# EAGLE design CS4272-breakout-board (EAGLE 8.6.3)
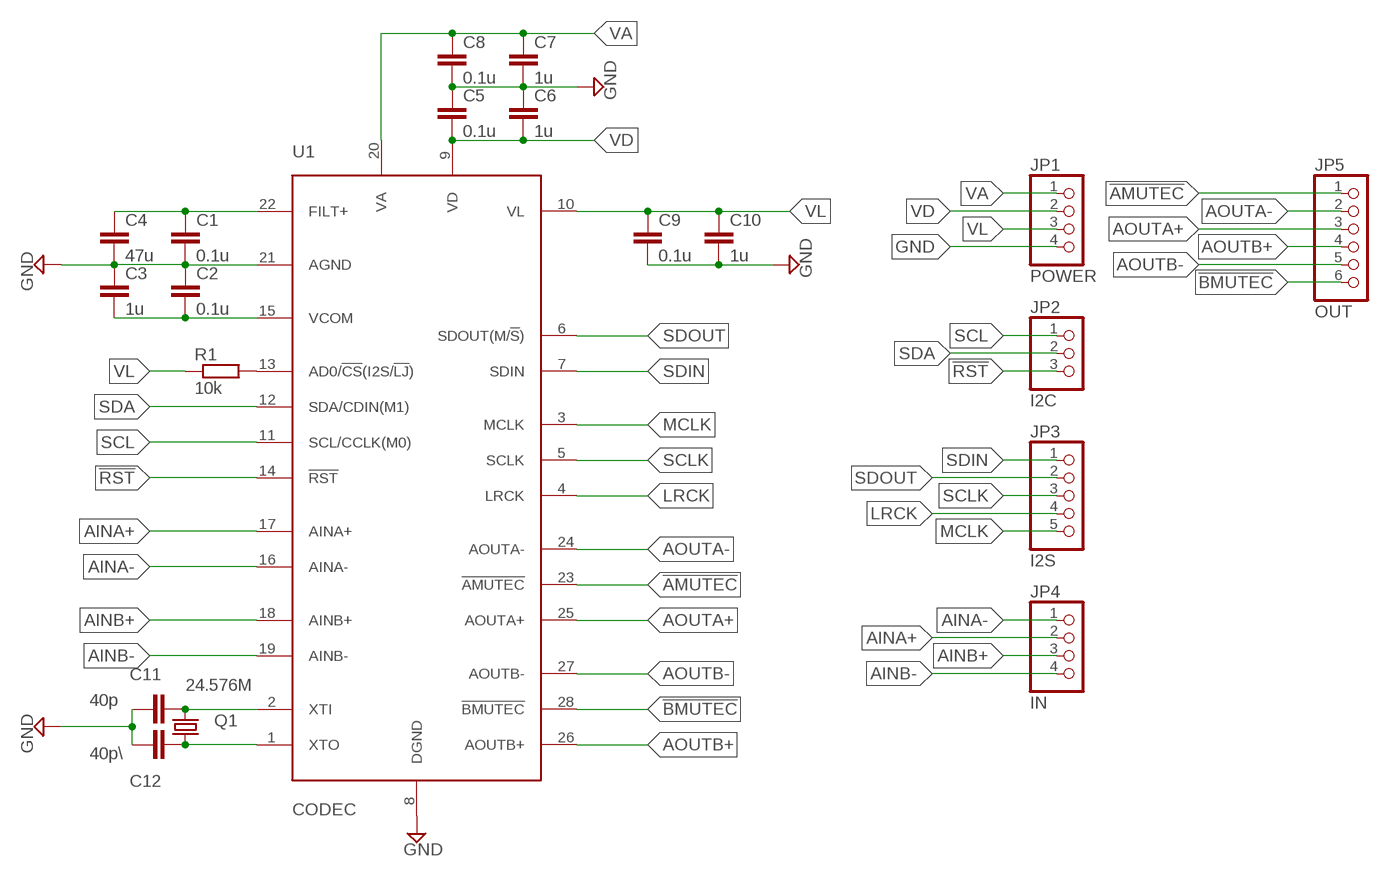
[diagram p0: schematic, sheet 1]

## Parts
C1  0.1u  C-EUC0603  [C0603]
C2  0.1u  C-EUC0603  [C0603]
C3  1u  C-EUC0603  [C0603]
C4  47u  C-EUC0603  [C0603]
C5  0.1u  C-EUC0603  [C0603]
C6  1u  C-EUC0603  [C0603]
C7  1u  C-EUC0603  [C0603]
C8  0.1u  C-EUC0603  [C0603]
C9  0.1u  C-EUC0603  [C0603]
C10  1u  C-EUC0603  [C0603]
C11  40p  C-EUC0603  [C0603]
C12  40p\  C-EUC0603  [C0603]
JP1  POWER  PINHD-1X4  [1X04]
JP2  I2C  PINHD-1X3  [1X03]
JP3  I2S  PINHD-1X5  [1X05]
JP4  IN  PINHD-1X4  [1X04]
JP5  OUT  PINHD-1X6  [1X06]
Q1  24.576M  CRYSTALHC49U-V  [HC49U-V]
R1  10k  R-EU_R0603  [R0603]
U1  CODEC  CS4272  [TSSOP-28]

## Nets
!AMUTEC!: JP5.1 U1.23(!AMUTEC!)
!BMUTEC!: JP5.6 U1.28(!BMUTEC!)
!RST!: JP2.3 U1.14(!RST!)
AINA+: JP4.2 U1.17(AINA+)
AINA-: JP4.1 U1.16(AINA-)
AINB+: JP4.3 U1.18(AINB+)
AINB-: JP4.4 U1.19(AINB-)
AOUTA+: JP5.3 U1.25(AOUTA+)
AOUTA-: JP5.2 U1.24(AOUTA-)
AOUTB+: JP5.4 U1.26(AOUTB+)
AOUTB-: JP5.5 U1.27(AOUTB-)
FILT+: C1.1 C4.1 U1.22(FILT+)
GND: C1.2 C2.1 C3.1 C4.2 C5.1 C6.1 C7.2 C8.2 C9.2 C10.2 C11.1 C12.1 JP1.4 U1.8(DGND) U1.21(AGND)
LRCK: JP3.4 U1.4(LRCK)
MCLK: JP3.5 U1.3(MCLK)
N$1: C12.2 Q1.1 U1.1(XTO)
N$2: C11.2 Q1.2 U1.2(XTI)
N$5: R1.2 U1.13(AD0/!CS!(I2S/!LJ!))
SCL: JP2.1 U1.11(SCL/CCLK(M0))
SCLK: JP3.3 U1.5(SCLK)
SDA: JP2.2 U1.12(SDA/CDIN(M1))
SDIN: JP3.1 U1.7(SDIN)
SDOUT: JP3.2 U1.6(SDOUT(M/!S!))
VA: C7.1 C8.1 JP1.1 U1.20(VA)
VCOM: C2.2 C3.2 U1.15(VCOM)
VD: C5.2 C6.2 JP1.2 U1.9(VD)
VL: C9.1 C10.1 JP1.3 R1.1 U1.10(VL)

## Library data of the parts
C1-C12 = rcl:C-EU: CAPACITOR, European symbol; SPICEPREFIX: C
JP1 JP4 = pinhead:PINHD-1X4: PIN HEADER
JP2 = pinhead:PINHD-1X3: PIN HEADER
JP3 = pinhead:PINHD-1X5: PIN HEADER
JP5 = pinhead:PINHD-1X6: PIN HEADER
Q1 = crystal:CRYSTAL: CRYSTAL; OC_FARNELL: 1666969; OC_NEWARK: unknown
R1 = rcl:R-EU_: RESISTOR, European symbol; SPICEPREFIX: R
U1 = CS4272:CS4272: 24-bit, 192 kHz Stereo Audio CODEC D/A Features High Performance 114 dB Dynamic Range -100 dB THD+N Up to 192 kHz Sampling Rates Differential Analog Architecture Volume Control with Soft Ramp 1 dB Step Size Zero Crossing Click-free Transitions Selectable Digital Filters Fast and Slow Roll Off ATAPI Mixing Functions Selectable Serial Audio Interface Formats Left Justified up to 24-bit I2S up to 24-bit Right Justified 16-, 18-, 20-, and 24-bit Control Output for External Muting Selectable 50/15 us De-emphasis A/D Features High Performance 114 dB Dynamic Range -100 dB THD+N Up to 192 kHz Sampling Rates Differential Analog Architecture Multi-bit Delta Sigma Conversion High-pass Filter or DC Offset Calibration Low-Latency Digital Anti-alias Filtering Automatic Dithering of 16-bit Data Selectable Serial Audio Interface Formats Left Justified up to 24-bit I2S up to 24-bit System Features Direct Interface with 5V to 2.5V Logic Levels Internal Digital Loopback On-chip Oscillator Stand-Alone or Control Port Functionality

## Board
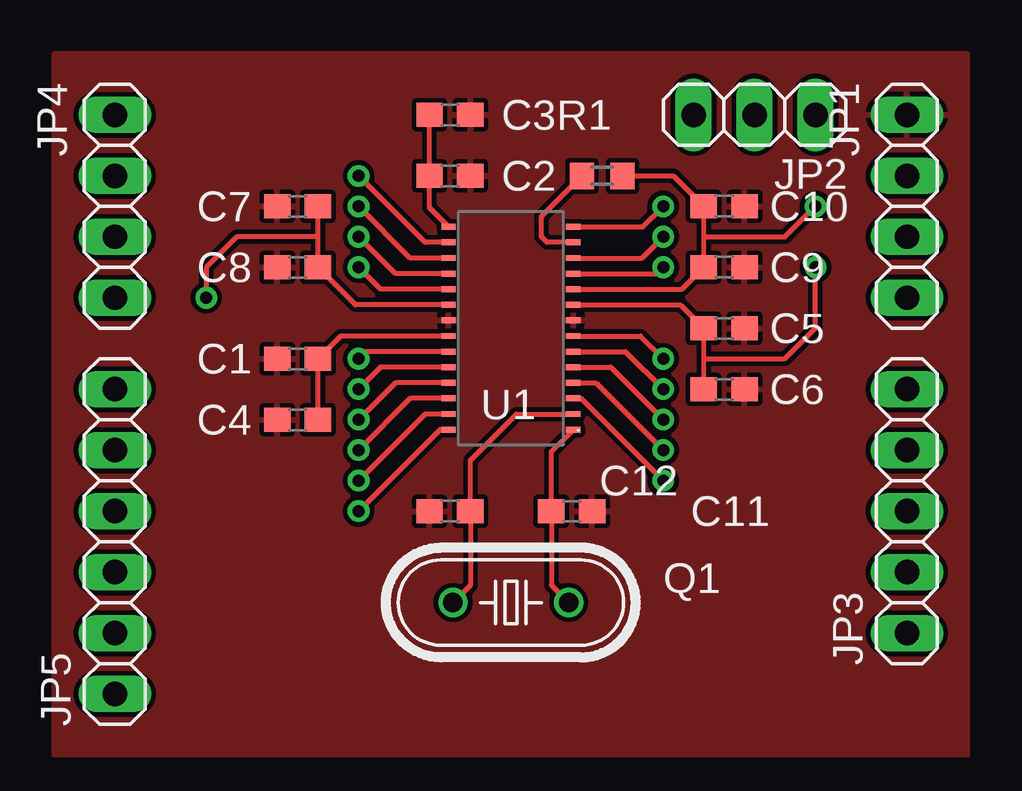
[diagram p1: board, top side]
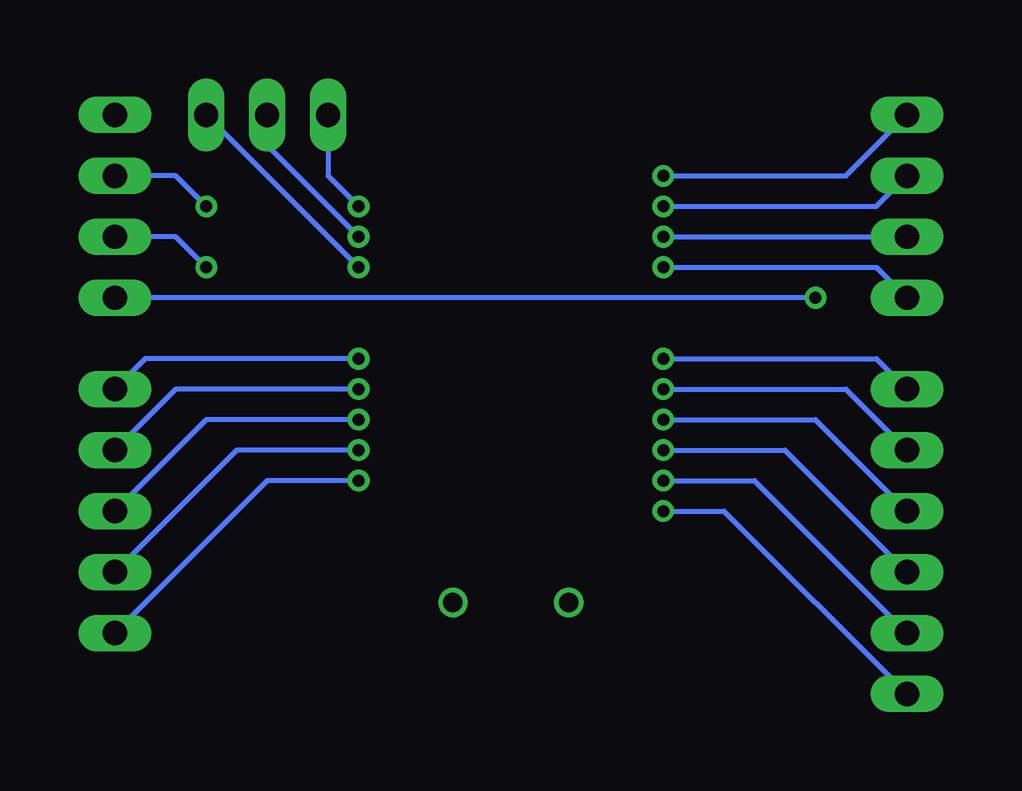
[diagram p2: board, bottom side, seen from below]

No outline drawn. Coordinates in mm, seen from the top.
Copper layers (1*16): Top 0.035mm / dielectric 1.5mm / Bottom 0.035mm
Design rules "minimal": minimum track width 0.2mm, minimum drill 0.5mm, track to track 0.2mm, track to pad 0.2mm, pad to pad 0.2mm, via to via 0.2mm, smd to smd 0.2mm, copper to edge 0.1mm, drill to drill 0.6mm, minimum pad ring 0.2mm, minimum via ring 0.2mm, stop-mask expansion 4mil, vias tented up to drill 0mil, thermal gap 0.2mm

### Footprints (pad centres in the part's own frame; a part is rotated, then mirrored left to right if it is on the bottom)
C0603 = smd 1.1 x 1: 1 -0.85,0; 2 0.85,0
1X04 = drill 1.016 long: 1 -3.81,0; 2 -1.27,0; 3 1.27,0; 4 3.81,0
1X03 = drill 1.016 long: 1 -2.54,0; 2 0,0; 3 2.54,0
1X05 = drill 1.016 long: 1 -5.08,0; 2 -2.54,0; 3 0,0; 4 2.54,0; 5 5.08,0
1X06 = drill 1.016 long: 1 -6.35,0; 2 -3.81,0; 3 -1.27,0; 4 1.27,0; 5 3.81,0; 6 6.35,0
HC49U-V = drill 0.813: 1 -2.413,0; 2 2.413,0
R0603 = smd 1 x 1.1: 1 -0.85,0; 2 0.85,0
TSSOP-28 = smd 0.245 x 0.6: 1 -4.225,-2.6; 2 -3.575,-2.6; 3 -2.925,-2.6; 4 -2.275,-2.6; 5 -1.625,-2.6; 6 -0.975,-2.6; 7 -0.325,-2.6; 8 0.325,-2.6; 9 0.975,-2.6; 10 1.625,-2.6; 11 2.275,-2.6; 12 2.925,-2.6; 13 3.575,-2.6; 14 4.225,-2.6; 15 4.225,2.6; 16 3.575,2.6; 17 2.925,2.6; 18 2.275,2.6; 19 1.625,2.6; 20 0.975,2.6; 21 0.325,2.6; 22 -0.325,2.6; 23 -0.975,2.6; 24 -1.625,2.6; 25 -2.275,2.6; 26 -2.925,2.6; 27 -3.575,2.6; 28 -4.225,2.6

### Placement (x,y rotation side)
C1  15.24,24.13 180 top
C2  21.59,31.75 180 top
C3  21.59,34.29 180 top
C4  15.24,21.59 180 top
C5  33.02,25.4 180 top
C6  33.02,22.86 180 top
C7  15.24,30.48 180 top
C8  15.24,27.94 180 top
C9  33.02,27.94 0 top
C10  33.02,30.48 0 top
C11  21.59,17.78 0 top
C12  26.67,17.78 180 top
JP1  40.64,30.48 90 top
JP2  34.29,34.29 180 top
JP3  40.64,17.78 270 top
JP4  7.62,30.48 270 top
JP5  7.62,16.51 270 top
Q1  24.13,13.97 180 top
R1  27.94,31.75 180 top
U1  24.13,25.4 90 top

### Tracks (layer width: path | path; a pad name or v marks a point on that pad's centre or on a via)
!AMUTEC!  (via drill 0.5)
  Top 0.2: U1.23 18.07,24.43 v17.78,24.13
  Bottom 0.2: JP5.1 8.89,24.13 v17.78,24.13
!BMUTEC!  (via drill 0.5)
  Top 0.2: U1.28 21.18,21.18 v17.78,17.78
  Bottom 0.2: v17.78,17.78 15.24,17.78 JP5.6
!RST!  (via drill 0.5)
  Top 0.2: U1.14 29.62,29.62 v30.48,30.48
  Bottom 0.2: JP2.3 31.75,31.75 v30.48,30.48
AINA+  (via drill 0.5)
  Top 0.2: U1.17 19.93,28.32 v17.78,30.48
  Bottom 0.2: v17.78,30.48 8.89,30.48 JP4.2
AINA-  (via drill 0.5)
  Top 0.2: U1.16 20.55,28.98 v17.78,31.75
  Bottom 0.2: v17.78,31.75 10.16,31.75 JP4.1
AINB+  (via drill 0.5)
  Top 0.2: U1.18 19.32,27.68 v17.78,29.21
  Bottom 0.2: v17.78,29.21 JP4.3
AINB-  (via drill 0.5)
  Top 0.2: U1.19 18.7,27.02 v17.78,27.94
  Bottom 0.2: JP4.4 8.89,27.94 v17.78,27.94
AOUTA+  (via drill 0.5)
  Top 0.2: U1.25 19.32,23.12 v17.78,21.59
  Bottom 0.2: v17.78,21.59 11.43,21.59 JP5.3
AOUTA-  (via drill 0.5)
  Top 0.2: U1.24 18.7,23.77 v17.78,22.86
  Bottom 0.2: v17.78,22.86 10.16,22.86 JP5.2
AOUTB+  (via drill 0.5)
  Top 0.2: U1.26 19.93,22.48 v17.78,20.32
  Bottom 0.2: v17.78,20.32 12.7,20.32 JP5.4
AOUTB-  (via drill 0.5)
  Top 0.2: U1.27 20.55,21.82 v17.78,19.05
  Bottom 0.2: v17.78,19.05 13.97,19.05 JP5.5
FILT+
  Top 0.2: C4.1 C1.1 17.04,25.07 U1.22
GND
  pour Top: 5.08,7.62 43.18,7.62 43.18,36.83 5.08,36.83
LRCK  (via drill 0.5)
  Top 0.2: U1.4 27.68,23.12 v30.48,20.32
  Bottom 0.2: JP3.4 35.56,20.32 v30.48,20.32
MCLK  (via drill 0.5)
  Top 0.2: U1.3 27.05,22.48 v30.48,19.05
  Bottom 0.2: v30.48,19.05 34.29,19.05 JP3.5
N$1
  Top 0.2: U1.1 25.82,20.27 C12.2 25.82,14.69 Q1.1
N$2
  Top 0.2: U1.2 24.36,21.82 22.44,19.9 C11.2 22.44,14.69 Q1.2
N$5
  Top 0.2: U1.13 25.64,28.98 25.4,29.21 25.4,30.06 R1.2
SCL  (via drill 0.5)
  Top 0.2: U1.11 30.21,27.68 v30.48,27.94
  Bottom 0.2: v30.48,27.94 JP2.1
SCLK  (via drill 0.5)
  Top 0.2: U1.5 28.3,23.77 v30.48,21.59
  Bottom 0.2: JP3.3 36.83,21.59 v30.48,21.59
SDA  (via drill 0.5)
  Top 0.2: U1.12 29.59,28.32 v30.48,29.21
  Bottom 0.2: JP2.2 34.29,33.02 v30.48,29.21
SDIN  (via drill 0.5)
  Top 0.2: U1.7 29.54,25.07 v30.48,24.13
  Bottom 0.2: v30.48,24.13 35.56,24.13 39.37,24.13 JP3.1
SDOUT  (via drill 0.5)
  Top 0.2: U1.6 28.91,24.43 v30.48,22.86
  Bottom 0.2: JP3.2 38.1,22.86 v30.48,22.86
VA  (via drill 0.5)
  Top 0.2: U1.20 17.66,26.38 C8.1 16.09,29.21 | 16.09,29.21 C7.1 | 16.09,29.21 12.7,29.21 11.43,27.94 v11.43,26.67
  Bottom 0.2: v11.43,26.67 JP1.1
VCOM
  Top 0.2: U1.15 20.74,30.41 C2.2 C3.2
VD  (via drill 0.5)
  Top 0.2: C6.2 32.17,24.13 | 32.17,24.13 C5.2 31.2,26.38 U1.9 | 32.17,24.13 35.56,24.13 36.83,25.4 v36.83,27.94
  Bottom 0.2: v36.83,27.94 38.1,29.21 JP1.2
VL  (via drill 0.5)
  Top 0.2: U1.10 31.25,27.02 C9.1 32.17,29.21 | 32.17,29.21 C10.1 30.9,31.75 R1.1 | 32.17,29.21 35.56,29.21 v36.83,30.48
  Bottom 0.2: v36.83,30.48 38.1,31.75 JP1.3